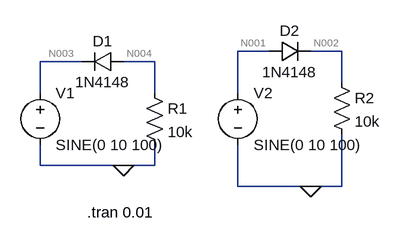
[diagram p0: schematic Draft4.asc]
Draft4.asc, the LTspice schematic file:
Version 4.1
SHEET 1 880 680
WIRE 400 32 352 32
WIRE 512 32 464 32
WIRE 112 48 48 48
WIRE 224 48 176 48
WIRE 512 80 512 32
WIRE 48 96 48 48
WIRE 224 96 224 48
WIRE 352 96 352 32
WIRE 48 208 48 176
WIRE 176 208 48 208
WIRE 224 208 224 176
WIRE 224 208 176 208
WIRE 352 240 352 176
WIRE 464 240 352 240
WIRE 512 240 512 160
WIRE 512 240 464 240
FLAG 176 208 0
FLAG 464 240 0
SYMBOL voltage 48 80 R0
WINDOW 123 0 0 Left 0
WINDOW 39 0 0 Left 0
SYMATTR InstName V1
SYMATTR Value SINE(0 10 100)
SYMBOL res 208 80 R0
SYMATTR InstName R1
SYMATTR Value 10k
SYMBOL diode 176 32 R90
WINDOW 0 0 32 VBottom 2
WINDOW 3 32 32 VTop 2
SYMATTR InstName D1
SYMATTR Value 1N4148
SYMBOL diode 400 48 R270
WINDOW 0 32 32 VTop 2
WINDOW 3 0 32 VBottom 2
SYMATTR InstName D2
SYMATTR Value 1N4148
SYMBOL res 496 64 R0
SYMATTR InstName R2
SYMATTR Value 10k
SYMBOL voltage 352 80 R0
WINDOW 123 0 0 Left 0
WINDOW 39 0 0 Left 0
SYMATTR InstName V2
SYMATTR Value SINE(0 10 100)
TEXT 120 280 Left 2 !.tran 0.01

The netlist it stands for:
* Draft4.asc
V1 N003 0 SINE(0 10 100)
R1 N004 0 10k
D1 N004 N003 1N4148
D2 N001 N002 1N4148
R2 N002 0 10k
V2 N001 0 SINE(0 10 100)
.model D D
.lib standard.dio
.tran 0.01
.backanno
.end

* Results of the author's LTspice run, read from the files saved beside the schematic
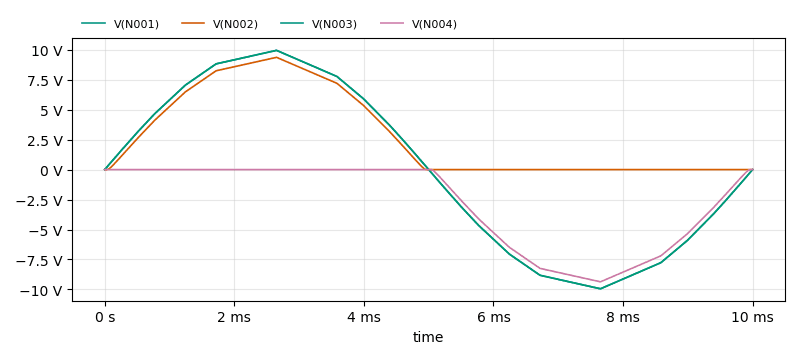
[diagram p1: Transient Analysis of Draft4.asc, plotted from the saved traces]
* Transient Analysis, 1 run:
*   V(N001): min -9.948 V, max 9.948 V, average 0 V, rms 6.956 V, last 0 V
*   V(N002): min -265.8 µV, max 9.366 V, average 2.854 V, rms 4.562 V, last 251.1 µV
*   V(N003): min -9.948 V, max 9.948 V, average 0 V, rms 6.956 V, last 0 V
*   V(N004): min -9.366 V, max 265.1 µV, average -2.854 V, rms 4.562 V, last 249.4 µV